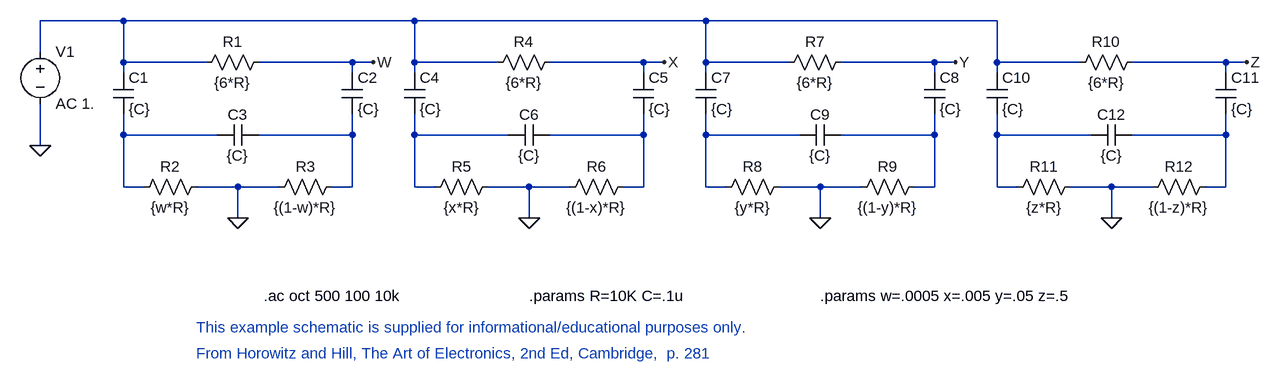
[diagram p0: schematic Fig_9-1_notch.asc]
Fig_9-1_notch.asc, the LTspice schematic file:
Version 4
SHEET 1 5945676 13421556
WIRE 1680 -496 1552 -496
WIRE 2128 -496 1680 -496
WIRE 2576 -496 2128 -496
WIRE 3024 -496 2576 -496
WIRE 1552 -448 1552 -496
WIRE 1680 -432 1680 -496
WIRE 1808 -432 1680 -432
WIRE 2032 -432 1888 -432
WIRE 2064 -432 2032 -432
WIRE 2128 -432 2128 -496
WIRE 2256 -432 2128 -432
WIRE 2480 -432 2336 -432
WIRE 2512 -432 2480 -432
WIRE 2576 -432 2576 -496
WIRE 2704 -432 2576 -432
WIRE 2928 -432 2784 -432
WIRE 2960 -432 2928 -432
WIRE 3024 -432 3024 -496
WIRE 3152 -432 3024 -432
WIRE 3376 -432 3232 -432
WIRE 3408 -432 3376 -432
WIRE 1680 -416 1680 -432
WIRE 2032 -416 2032 -432
WIRE 2128 -416 2128 -432
WIRE 2480 -416 2480 -432
WIRE 2576 -416 2576 -432
WIRE 2928 -416 2928 -432
WIRE 3024 -416 3024 -432
WIRE 3376 -416 3376 -432
WIRE 1680 -320 1680 -352
WIRE 1824 -320 1680 -320
WIRE 2032 -320 2032 -352
WIRE 2032 -320 1888 -320
WIRE 2128 -320 2128 -352
WIRE 2272 -320 2128 -320
WIRE 2480 -320 2480 -352
WIRE 2480 -320 2336 -320
WIRE 2576 -320 2576 -352
WIRE 2720 -320 2576 -320
WIRE 2928 -320 2928 -352
WIRE 2928 -320 2784 -320
WIRE 3024 -320 3024 -352
WIRE 3168 -320 3024 -320
WIRE 3376 -320 3376 -352
WIRE 3376 -320 3232 -320
WIRE 1552 -304 1552 -368
WIRE 1680 -240 1680 -320
WIRE 1712 -240 1680 -240
WIRE 1856 -240 1792 -240
WIRE 1920 -240 1856 -240
WIRE 2032 -240 2032 -320
WIRE 2032 -240 2000 -240
WIRE 2128 -240 2128 -320
WIRE 2160 -240 2128 -240
WIRE 2304 -240 2240 -240
WIRE 2368 -240 2304 -240
WIRE 2480 -240 2480 -320
WIRE 2480 -240 2448 -240
WIRE 2576 -240 2576 -320
WIRE 2608 -240 2576 -240
WIRE 2752 -240 2688 -240
WIRE 2816 -240 2752 -240
WIRE 2928 -240 2928 -320
WIRE 2928 -240 2896 -240
WIRE 3024 -240 3024 -320
WIRE 3056 -240 3024 -240
WIRE 3200 -240 3136 -240
WIRE 3264 -240 3200 -240
WIRE 3376 -240 3376 -320
WIRE 3376 -240 3344 -240
WIRE 1856 -192 1856 -240
WIRE 2304 -192 2304 -240
WIRE 2752 -192 2752 -240
WIRE 3200 -192 3200 -240
FLAG 1552 -304 0
FLAG 1856 -192 0
FLAG 2064 -432 W
FLAG 2304 -192 0
FLAG 2512 -432 X
FLAG 2752 -192 0
FLAG 2960 -432 Y
FLAG 3200 -192 0
FLAG 3408 -432 Z
SYMBOL voltage 1552 -464 R0
SYMATTR InstName V1
SYMATTR Value AC 1.
SYMBOL res 1904 -448 R90
WINDOW 0 0 56 VBottom 2
WINDOW 3 32 56 VTop 2
SYMATTR InstName R1
SYMATTR Value {6*R}
SYMBOL cap 2016 -416 R0
SYMATTR InstName C2
SYMATTR Value {C}
SYMBOL cap 1664 -416 R0
SYMATTR InstName C1
SYMATTR Value {C}
SYMBOL cap 1888 -336 R90
WINDOW 0 0 32 VBottom 2
WINDOW 3 32 32 VTop 2
SYMATTR InstName C3
SYMATTR Value {C}
SYMBOL res 1808 -256 R90
WINDOW 0 0 56 VBottom 2
WINDOW 3 32 56 VTop 2
SYMATTR InstName R2
SYMATTR Value {w*R}
SYMBOL res 2016 -256 R90
WINDOW 0 0 56 VBottom 2
WINDOW 3 32 56 VTop 2
SYMATTR InstName R3
SYMATTR Value {(1-w)*R}
SYMBOL res 2352 -448 R90
WINDOW 0 0 56 VBottom 2
WINDOW 3 32 56 VTop 2
SYMATTR InstName R4
SYMATTR Value {6*R}
SYMBOL cap 2112 -416 R0
SYMATTR InstName C4
SYMATTR Value {C}
SYMBOL cap 2464 -416 R0
SYMATTR InstName C5
SYMATTR Value {C}
SYMBOL cap 2336 -336 R90
WINDOW 0 0 32 VBottom 2
WINDOW 3 32 32 VTop 2
SYMATTR InstName C6
SYMATTR Value {C}
SYMBOL res 2256 -256 R90
WINDOW 0 0 56 VBottom 2
WINDOW 3 32 56 VTop 2
SYMATTR InstName R5
SYMATTR Value {x*R}
SYMBOL res 2464 -256 R90
WINDOW 0 0 56 VBottom 2
WINDOW 3 32 56 VTop 2
SYMATTR InstName R6
SYMATTR Value {(1-x)*R}
SYMBOL res 2800 -448 R90
WINDOW 0 0 56 VBottom 2
WINDOW 3 32 56 VTop 2
SYMATTR InstName R7
SYMATTR Value {6*R}
SYMBOL cap 2560 -416 R0
SYMATTR InstName C7
SYMATTR Value {C}
SYMBOL cap 2912 -416 R0
SYMATTR InstName C8
SYMATTR Value {C}
SYMBOL cap 2784 -336 R90
WINDOW 0 0 32 VBottom 2
WINDOW 3 32 32 VTop 2
SYMATTR InstName C9
SYMATTR Value {C}
SYMBOL res 2704 -256 R90
WINDOW 0 0 56 VBottom 2
WINDOW 3 32 56 VTop 2
SYMATTR InstName R8
SYMATTR Value {y*R}
SYMBOL res 2912 -256 R90
WINDOW 0 0 56 VBottom 2
WINDOW 3 32 56 VTop 2
SYMATTR InstName R9
SYMATTR Value {(1-y)*R}
SYMBOL res 3248 -448 R90
WINDOW 0 0 56 VBottom 2
WINDOW 3 32 56 VTop 2
SYMATTR InstName R10
SYMATTR Value {6*R}
SYMBOL cap 3008 -416 R0
SYMATTR InstName C10
SYMATTR Value {C}
SYMBOL cap 3360 -416 R0
SYMATTR InstName C11
SYMATTR Value {C}
SYMBOL cap 3232 -336 R90
WINDOW 0 0 32 VBottom 2
WINDOW 3 32 32 VTop 2
SYMATTR InstName C12
SYMATTR Value {C}
SYMBOL res 3152 -256 R90
WINDOW 0 0 56 VBottom 2
WINDOW 3 32 56 VTop 2
SYMATTR InstName R11
SYMATTR Value {z*R}
SYMBOL res 3360 -256 R90
WINDOW 0 0 56 VBottom 2
WINDOW 3 32 56 VTop 2
SYMATTR InstName R12
SYMATTR Value {(1-z)*R}
TEXT 1896 -72 Left 2 !.ac oct 500 100 10k
TEXT 2304 -72 Left 2 !.params R=10K C=.1u
TEXT 1792 16 Left 2 ;From Horowitz and Hill, The Art of Electronics, 2nd Ed, Cambridge,  p. 281
TEXT 2752 -72 Left 2 !.params w=.0005 x=.005 y=.05 z=.5
TEXT 1792 -24 Left 2 ;This example schematic is supplied for informational/educational purposes only.

The netlist it stands for:
* Fig_9-1_notch.asc
V1 N001 0 AC 1.
R1 W N001 {6*R}
C2 W N003 {C}
C1 N001 N002 {C}
C3 N003 N002 {C}
R2 0 N002 {w*R}
R3 N003 0 {(1-w)*R}
R4 X N001 {6*R}
C4 N001 N004 {C}
C5 X N005 {C}
C6 N005 N004 {C}
R5 0 N004 {x*R}
R6 N005 0 {(1-x)*R}
R7 Y N001 {6*R}
C7 N001 N006 {C}
C8 Y N007 {C}
C9 N007 N006 {C}
R8 0 N006 {y*R}
R9 N007 0 {(1-y)*R}
R10 Z N001 {6*R}
C10 N001 N008 {C}
C11 Z N009 {C}
C12 N009 N008 {C}
R11 0 N008 {z*R}
R12 N009 0 {(1-z)*R}
.ac oct 500 100 10k
.params R=10K C=.1u
* From Horowitz and Hill, The Art of Electronics, 2nd Ed, Cambridge,  p. 281
.params w=.0005 x=.005 y=.05 z=.5
* This example schematic is supplied for informational/educational purposes only.
.backanno
.end